# Altium schematic sheet dmpro16-pcb-v1-TopLevel.SchDoc
size A4; DocumentNumber: 1; SheetNumber: 1; SheetTotal: 17; SheetName: TopLevel
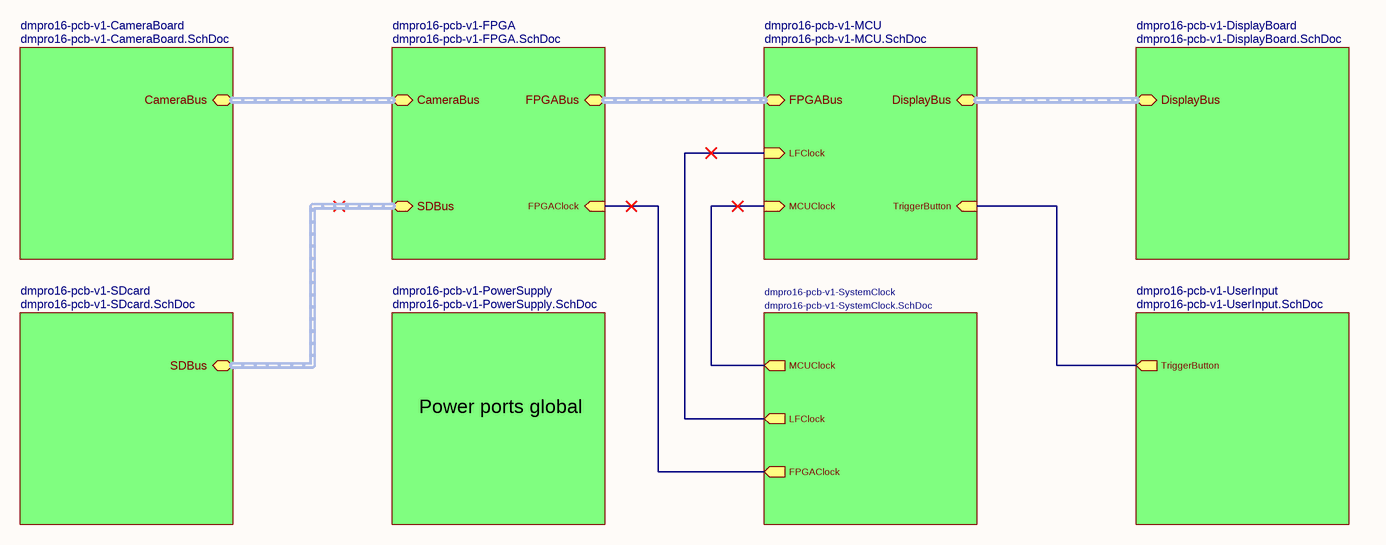
[diagram p0: dmpro16-pcb-v1-TopLevel.SchDoc]

## Sub-sheets
dmpro16-pcb-v1-CameraBoard = dmpro16-pcb-v1-CameraBoard.SchDoc: CameraBus (harness CameraBus)
dmpro16-pcb-v1-DisplayBoard = dmpro16-pcb-v1-DisplayBoard.SchDoc: DisplayBus (harness DisplayBus)
dmpro16-pcb-v1-FPGA = dmpro16-pcb-v1-FPGA.SchDoc: CameraBus (harness CameraBus), FPGABus (harness FPGABus), SDBus (harness SDBus), FPGAClock (in)
dmpro16-pcb-v1-MCU = dmpro16-pcb-v1-MCU.SchDoc: FPGABus (harness FPGABus), DisplayBus (harness DisplayBus), MCUClock (in), TriggerButton (in), LFClock (in)
dmpro16-pcb-v1-PowerSupply = dmpro16-pcb-v1-PowerSupply.SchDoc: no entries
dmpro16-pcb-v1-SDcard = dmpro16-pcb-v1-SDcard.SchDoc: SDBus (harness SDBus)
dmpro16-pcb-v1-SystemClock = dmpro16-pcb-v1-SystemClock.SchDoc: MCUClock (out), LFClock (out), FPGAClock (out)
dmpro16-pcb-v1-UserInput = dmpro16-pcb-v1-UserInput.SchDoc: TriggerButton (out)

## Nets
(unnamed): sheet dmpro16-pcb-v1-FPGA/FPGAClock, sheet dmpro16-pcb-v1-SystemClock/FPGAClock
(unnamed): sheet dmpro16-pcb-v1-MCU/MCUClock, sheet dmpro16-pcb-v1-SystemClock/MCUClock
(unnamed): sheet dmpro16-pcb-v1-MCU/TriggerButton, sheet dmpro16-pcb-v1-UserInput/TriggerButton
(unnamed): sheet dmpro16-pcb-v1-MCU/LFClock, sheet dmpro16-pcb-v1-SystemClock/LFClock

## Buses and harness runs
harness sheet dmpro16-pcb-v1-CameraBoard/CameraBus = sheet dmpro16-pcb-v1-FPGA/CameraBus
harness sheet dmpro16-pcb-v1-DisplayBoard/DisplayBus = sheet dmpro16-pcb-v1-MCU/DisplayBus
harness sheet dmpro16-pcb-v1-FPGA/FPGABus = sheet dmpro16-pcb-v1-MCU/FPGABus
harness sheet dmpro16-pcb-v1-FPGA/SDBus = sheet dmpro16-pcb-v1-SDcard/SDBus

## Notes on the sheet
- Power ports global
- Board:
- Version:
- Sheetname:
- Subject:
- Group:
- Sheet
- of
- Shematic file: